# EAGLE design ADS1271_top (EAGLE 7.5.0)
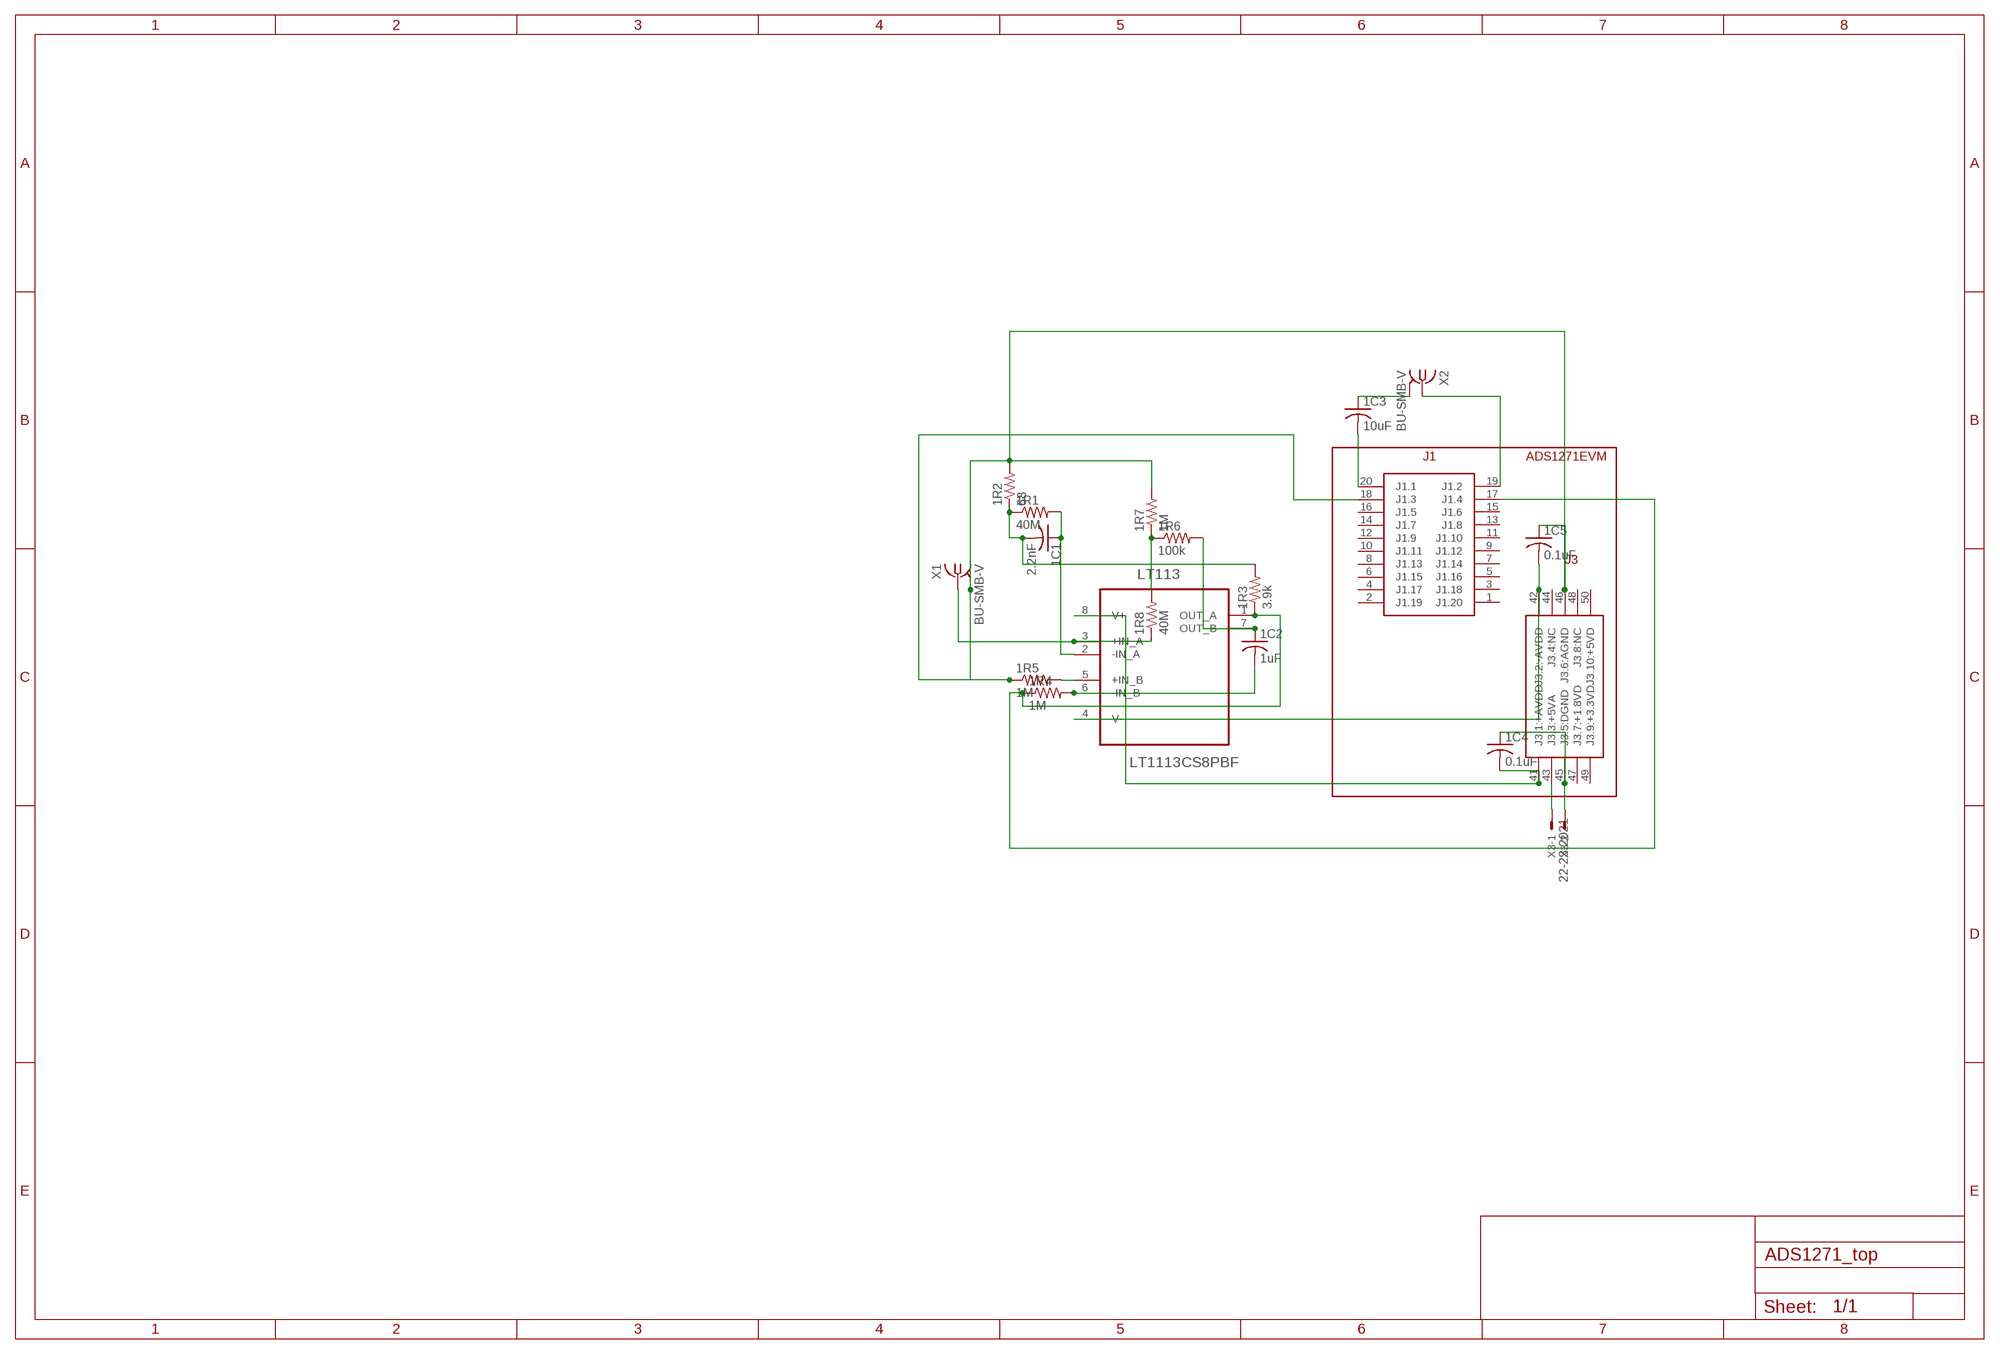
[diagram p0: schematic, sheet 1]

## Parts
1C1  2.2nF  ADAFRUIT_C-USC0805K  [ADAFRUIT_C0805K]
1C2  1uF  ADAFRUIT_C-USC0805K  [ADAFRUIT_C0805K]
1C3  10uF  ADAFRUIT_C-USC0805K  [ADAFRUIT_C0805K]
1C4  0.1uF  ADAFRUIT_C-USC0805K  [ADAFRUIT_C0805K]
1C5  0.1uF  ADAFRUIT_C-USC0805K  [ADAFRUIT_C0805K]
1R1  40M  ADAFRUIT_R-US_R0805  [ADAFRUIT_R0805]
1R2  68  ADAFRUIT_R-US_R0805  [ADAFRUIT_R0805]
1R3  3.9k  ADAFRUIT_R-US_R0805  [ADAFRUIT_R0805]
1R4  1M  ADAFRUIT_R-US_R0805  [ADAFRUIT_R0805]
1R5  1M  ADAFRUIT_R-US_R0805  [ADAFRUIT_R0805]
1R6  100k  ADAFRUIT_R-US_R0805  [ADAFRUIT_R0805]
1R7  1M  ADAFRUIT_R-US_R0805  [ADAFRUIT_R0805]
1R8  40M  ADAFRUIT_R-US_R0805  [ADAFRUIT_R0805]
ADS1271_CONNECTORS  BENS_LIBRARY_ADS1271EVM_PART  [BENS_LIBRARY_ADS1271EVM_PART]
LT113  LT1113CS8PBF  [SOIC127P600X175-8N]
X1  BU-SMB-V  [BU-SMB-V]
X2  BU-SMB-V  [BU-SMB-V]
X3  22-23-2021  [22-23-2021]

## Nets
1+IN_B: 1R5.2 LT113.5(+IN_B)
1-IN_A: 1C1.1 1R1.2 LT113.2(-IN_A)
1-IN_B: 1C2.2 1R4.2 LT113.6(-IN_B)
1OUT_B: 1C2.1 1R6.2 LT113.7(OUT_B)
1W1: 1C1.2 1R1.1 1R2.1 1R3.2
1W2: 1R6.1 1R7.1 1R8.2
ADC1_NEG: 1R3.1 1R4.1 ADS1271_CONNECTORS.17(J1.4) LT113.1(OUT_A)
ADC1_POS: 1C4.1 1C5.1 1R2.2 1R5.1 1R7.2 ADS1271_CONNECTORS.18(J1.3) ADS1271_CONNECTORS.45(J3.5:DGND) ADS1271_CONNECTORS.46(J3.6:AGND) X1.2 X1.3 X1.4 X1.5 X3.2
ADC2_GND: 1C3.1 X2.2 X2.3 X2.4 X2.5
ADC2_NEG: ADS1271_CONNECTORS.19(J1.2) X2.1
ADC2_POS: 1C3.2 ADS1271_CONNECTORS.20(J1.1)
INPUT1_NEG: 1R8.1 LT113.3(+IN_A) X1.1
N$1: ADS1271_CONNECTORS.43(J3.3:+5VA) X3.1
N$3: 1C5.2 ADS1271_CONNECTORS.42(J3.2:-AVDD) LT113.4(V-)
N$4: 1C4.2 ADS1271_CONNECTORS.41(J3.1:+AVDD) LT113.8(V+)
Unconnected: ADS1271_CONNECTORS.1(J1.20) ADS1271_CONNECTORS.2(J1.19) ADS1271_CONNECTORS.3(J1.18) ADS1271_CONNECTORS.4(J1.17) ADS1271_CONNECTORS.5(J1.16) ADS1271_CONNECTORS.6(J1.15) ADS1271_CONNECTORS.7(J1.14) ADS1271_CONNECTORS.8(J1.13) ADS1271_CONNECTORS.9(J1.12) ADS1271_CONNECTORS.10(J1.11) ADS1271_CONNECTORS.11(J1.10) ADS1271_CONNECTORS.12(J1.9) ADS1271_CONNECTORS.13(J1.8) ADS1271_CONNECTORS.14(J1.7) ADS1271_CONNECTORS.15(J1.6) ADS1271_CONNECTORS.16(J1.5) ADS1271_CONNECTORS.44(J3.4:NC) ADS1271_CONNECTORS.47(J3.7:+1.8VD) ADS1271_CONNECTORS.48(J3.8:NC) ADS1271_CONNECTORS.49(J3.9:+3.3VD) ADS1271_CONNECTORS.50(J3.10:+5VD)

## Library data of the parts
1C1-1C5 = BBB_ADS1271_front_panel:ADAFRUIT_C-US: CAPACITOR, American symbol
1R1-1R8 = BBB_ADS1271_front_panel:ADAFRUIT_R-US_: RESISTOR, American symbol
ADS1271_CONNECTORS = BBB_ADS1271_cape:BENS_LIBRARY_ADS1271EVM_PART
LT113 = BBB_ADS1271_front_panel:LT1113CS8PBF: Dual Low Noise,Precision, JFET Input Op Amp; MPN: LT1113CS8#PBF; OC_FARNELL: 1503417; OC_NEWARK: 57M1747; PACKAGE: SOIC-8; SUPPLIER: Linear Technology
X1 X2 = BBB_ADS1271_front_panel:BU-SMB-V: FEMALE SMB CONNECTOR Radiall distributor RS 112-2993; OC_FARNELL: unknown; OC_NEWARK: unknown
X3 = con-molex:22-23-2021: .100" (2.54mm) Center Header - 2 Pin; MF: MOLEX; MPN: 22-23-2021; OC_FARNELL: 1462926; OC_NEWARK: 25C3832

## Board
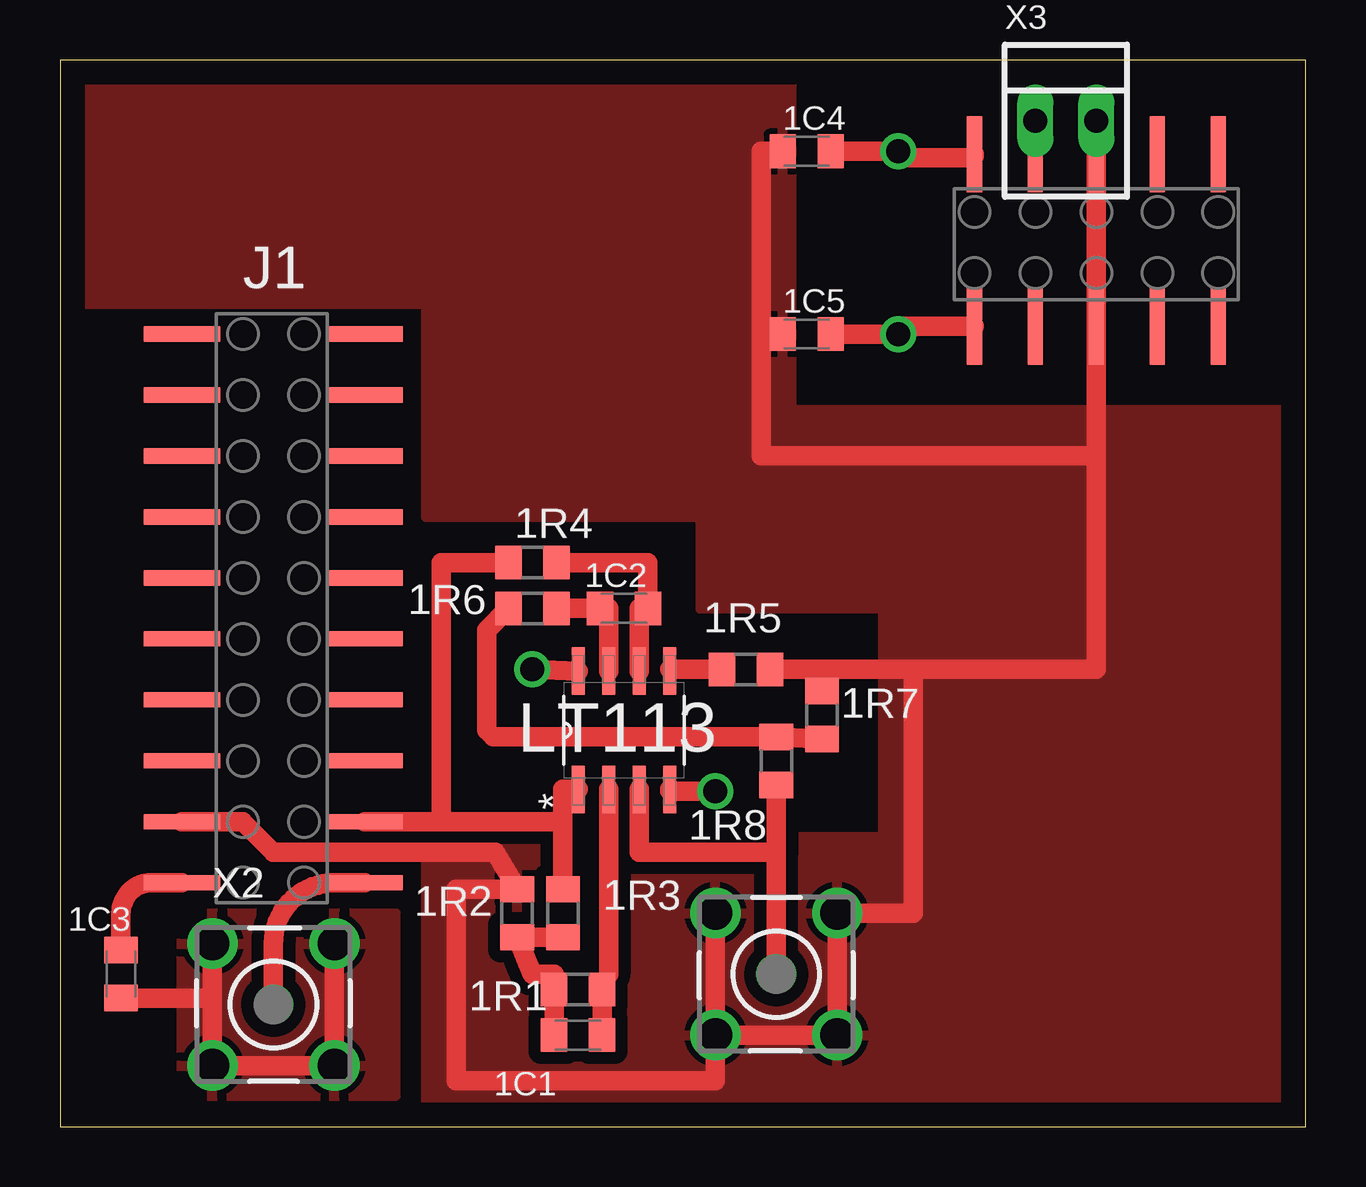
[diagram p1: board, top side]
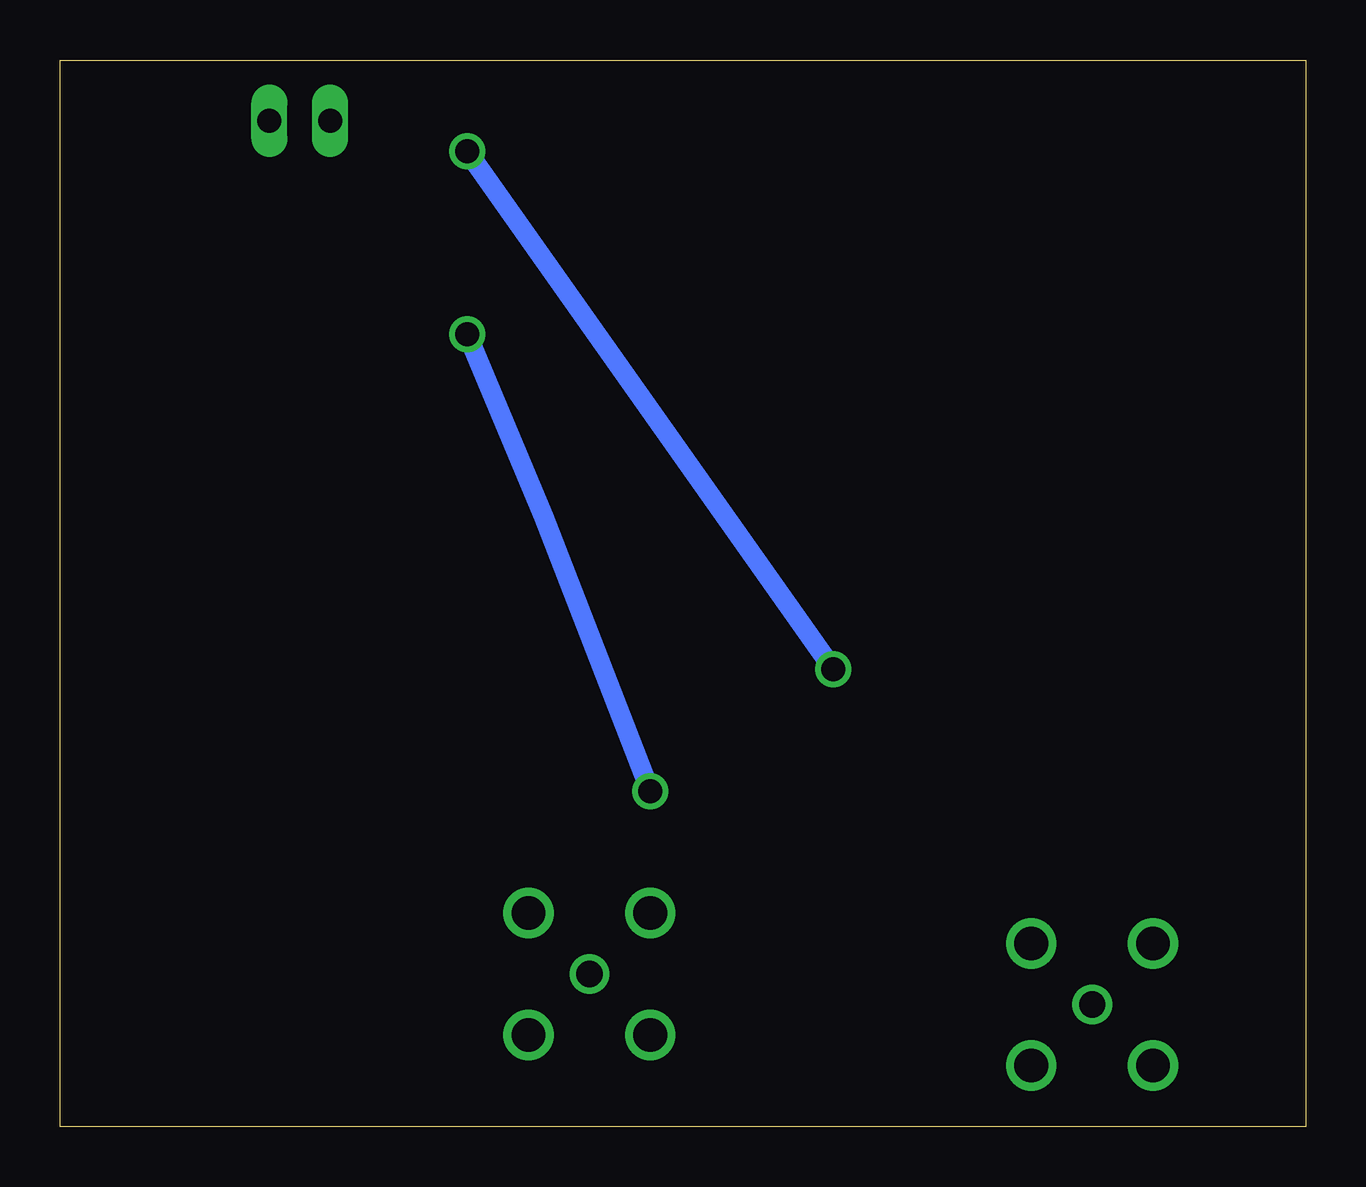
[diagram p2: board, bottom side, seen from below]

Size 51.9 x 44.44 mm. Coordinates in mm from the lower left corner, seen from the top.
Outline: 0,0 51.9,0 51.9,44.44 0,44.44 0,0
Copper layers (1*16): Top 0.035mm / dielectric 1.5mm / Bottom 0.035mm
Design rules "pcb_design_rules": minimum track width 10mil, minimum drill 24mil, track to track 20mil, track to pad 20mil, pad to pad 8mil, via to via 20mil, smd to smd 8mil, copper to edge 40mil, drill to drill 8mil, minimum pad ring 10mil, minimum via ring 8mil, stop-mask expansion 4mil, vias tented up to drill 0mil, thermal gap 10mil

### Footprints (pad centres in the part's own frame; a part is rotated, then mirrored left to right if it is on the bottom)
ADAFRUIT_C0805K = smd 1.1 x 1.4: 1 -1,0; 2 1,0
ADAFRUIT_R0805 = smd 1.1 x 1.4: 1 -1,0; 2 1,0
BENS_LIBRARY_ADS1271EVM_PART = smd 3.175 x 0.635: 1 7.62,30.48; 2 0,30.48; 3 7.62,27.94; 4 0,27.94; 5 7.62,25.4; 6 0,25.4; 7 7.62,22.86; 8 0,22.86; 9 7.62,20.32; 10 0,20.32; 11 7.62,17.78; 12 0,17.78; 13 7.62,15.24; 14 0,15.24; 15 7.62,12.7; 16 0,12.7; 17 7.62,10.16; 18 0,10.16; 19 7.62,7.62; 20 0,7.62 | smd 0.635 x 3.175: 41 33.02,37.973; 42 33.02,30.797; 43 35.56,37.973; 44 35.56,30.797; 45 38.1,37.973; 46 38.1,30.797; 47 40.64,37.973; 48 40.64,30.797; 49 43.18,37.973; 50 43.18,30.797
SOIC127P600X175-8N = smd 1.981 x 0.533: 1 -2.464,1.905; 2 -2.464,0.635; 3 -2.464,-0.635; 4 -2.464,-1.905; 5 2.464,-1.905; 6 2.464,-0.635; 7 2.464,0.635; 8 2.464,1.905
BU-SMB-V = drill 1.1: 1 0,0 | drill 1.4: 2 -2.54,2.54; 3 2.54,2.54; 4 2.54,-2.54; 5 -2.54,-2.54
22-23-2021 = drill 1 long: 1 -1.27,0; 2 1.27,0

### Placement (x,y rotation side)
1C1  21.59,3.81 180 top
1C2  23.5,21.59 0 top
1C3  2.54,6.35 90 top
1C4  31.11,40.64 0 top
1C5  31.11,33.02 0 top
1R1  21.59,5.71 0 top
1R2  19.05,8.89 90 top
1R3  20.95,8.89 270 top
1R4  19.68,23.5 0 top
1R5  28.57,19.05 180 top
1R6  19.68,21.59 0 top
1R7  31.75,17.14 90 top
1R8  29.84,15.24 90 top
ADS1271_CONNECTORS  5.08,2.54 0 top
LT113  23.5,16.51 90 top
X1  29.84,6.35 180 top
X2  8.89,5.08 0 top
X3  41.91,41.91 0 top

### Tracks (layer width: path | path; a pad name or v marks a point on that pad's centre or on a via)
1+IN_B
  Top 0.406: LT113.5 25.4,19.05
  Top 0.813: 25.4,19.05 1R5.2
1-IN_A
  Top 0.406: 22.86,6.35 1R1.2
  Top 0.813: 1R1.2 1C1.1 | LT113.2 22.86,6.35
1-IN_B
  Top 0.406: 24.13,21.59 1C2.2
  Top 0.813: LT113.6 24.13,21.59 | 1C2.2 24.5,23.5 1R4.2
1OUT_B
  Top 0.406: 1C2.1 22.86,21.59
  Top 0.813: 1C2.1 1R6.2 | 22.86,21.59 LT113.7
1W1
  Top 0.813: 1C1.2 1R1.1 20.59,6.35 19.68,6.35 1R2.1 1R3.2
1W2
  Top 0.813: 1R7.1 1R8.2 18.05,16.24 17.78,16.51 17.78,20.68 1R6.1
ADC1_NEG
  Top 0.813: 1R4.1 15.88,23.5 15.88,12.7 | ADS1271_CONNECTORS.17 15.88,12.7 | 1R3.1 20.95,12.7 | 20.95,12.7 20.95,14.05 LT113.1 | 15.88,12.7 20.95,12.7
ADC1_POS
  Top 0.406: 43.18,40.64 X3.2
  Top 0.813: ADS1271_CONNECTORS.45 ADS1271_CONNECTORS.46 43.18,19.05 35.56,19.05 | ADS1271_CONNECTORS.45 43.18,40.64 | ADS1271_CONNECTORS.18 7.62,12.7 8.89,11.43 18.14,11.43 1R2.2 16.51,9.89 16.51,1.91 27.3,1.91 X1.3 | 1R5.1 31.75,19.05 | 31.75,19.05 1R7.2 | 35.56,19.05 31.75,19.05 | X1.3 X1.4 | X1.3 X1.2 X1.5 35.56,8.89 35.56,19.05 | ADS1271_CONNECTORS.45 43.18,27.94 29.21,27.94 29.21,33.02 | 29.21,33.02 29.21,40.64 1C4.1 | 1C5.1 29.21,33.02
  pour Top: 0.64,34.29 15.24,34.29 15.24,25.4 26.67,25.4 26.67,21.59 34.29,21.59 34.29,12.06 15.24,12.06 15.24,0.64 52.07,0.64 52.07,29.84 30.48,29.84 30.48,43.81 0.64,43.81
ADC2_GND
  Top 0.813: X2.3 X2.4 X2.5 6.35,5.08 | 6.35,5.08 X2.2 | 1C3.1 6.08,5.35 arc-90 6.35,5.08
  pour Top: 5.08,1.27 5.08,8.89 13.97,8.89 13.97,1.27
ADC2_NEG
  Top 0.813: ADS1271_CONNECTORS.19 11.43,10.16 arc90 8.89,7.62 X2.1
ADC2_POS
  Top 0.813: 1C3.2 2.54,8.89 arc-90 3.81,10.16 ADS1271_CONNECTORS.20
INPUT1_NEG
  Top 0.813: LT113.3 24.13,11.43 29.84,11.43 1R8.1 X1.1
N$1
  Top 0.406: ADS1271_CONNECTORS.43 X3.1
N$3  (via drill 1)
  Top 0.813: LT113.4 arc90 25.48,13.97 v27.3,13.97 | ADS1271_CONNECTORS.42 34.92,33.34 v34.92,33.02 1C5.2
  Bottom 0.813: v34.92,33.02 31.75,25.4 v27.3,13.97
N$4  (via drill 1)
  Top 0.813: ADS1271_CONNECTORS.41 arc-90 37.96,40.37 34.92,40.37 v34.92,40.64 1C4.2 | v19.68,19.05 LT113.8
  Bottom 0.813: v34.92,40.64 v19.68,19.05

### Text on the board
tNames: J1